# EAGLE board ROV_Main_Board (EAGLE 7.5.0), part 1 of 2
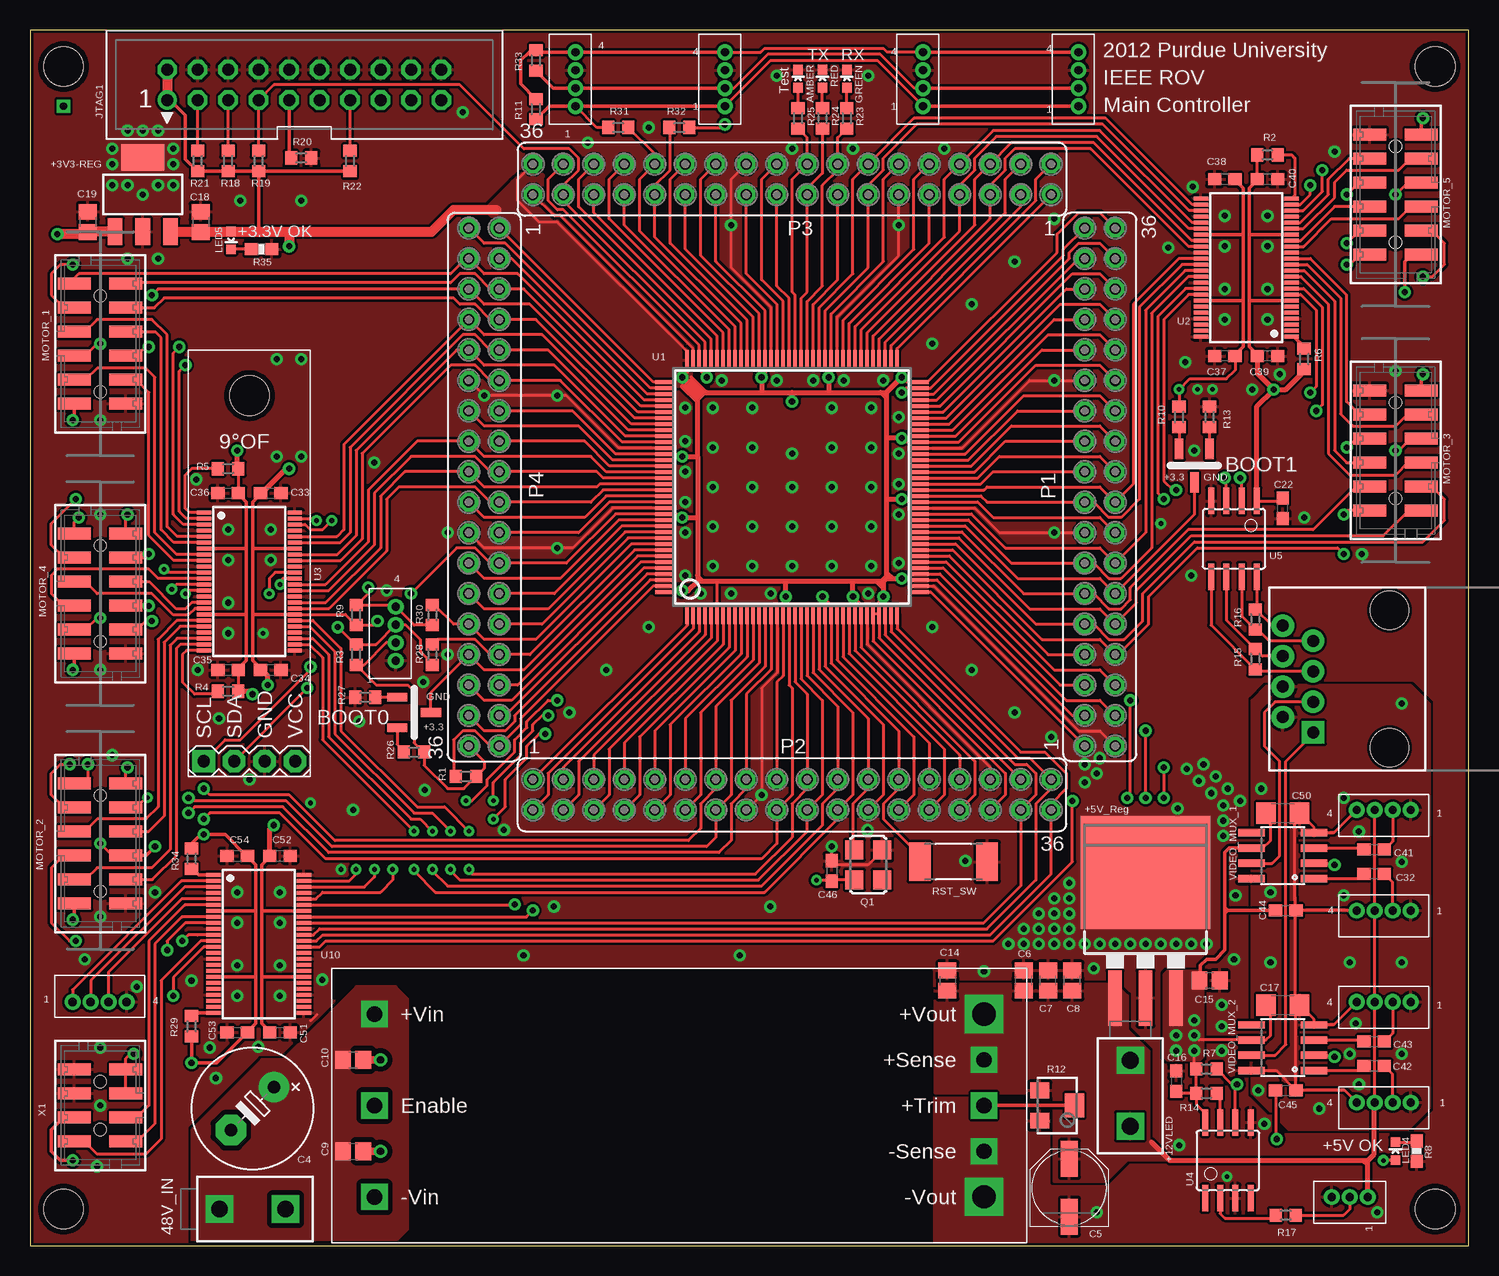
[diagram p2: board, top side]
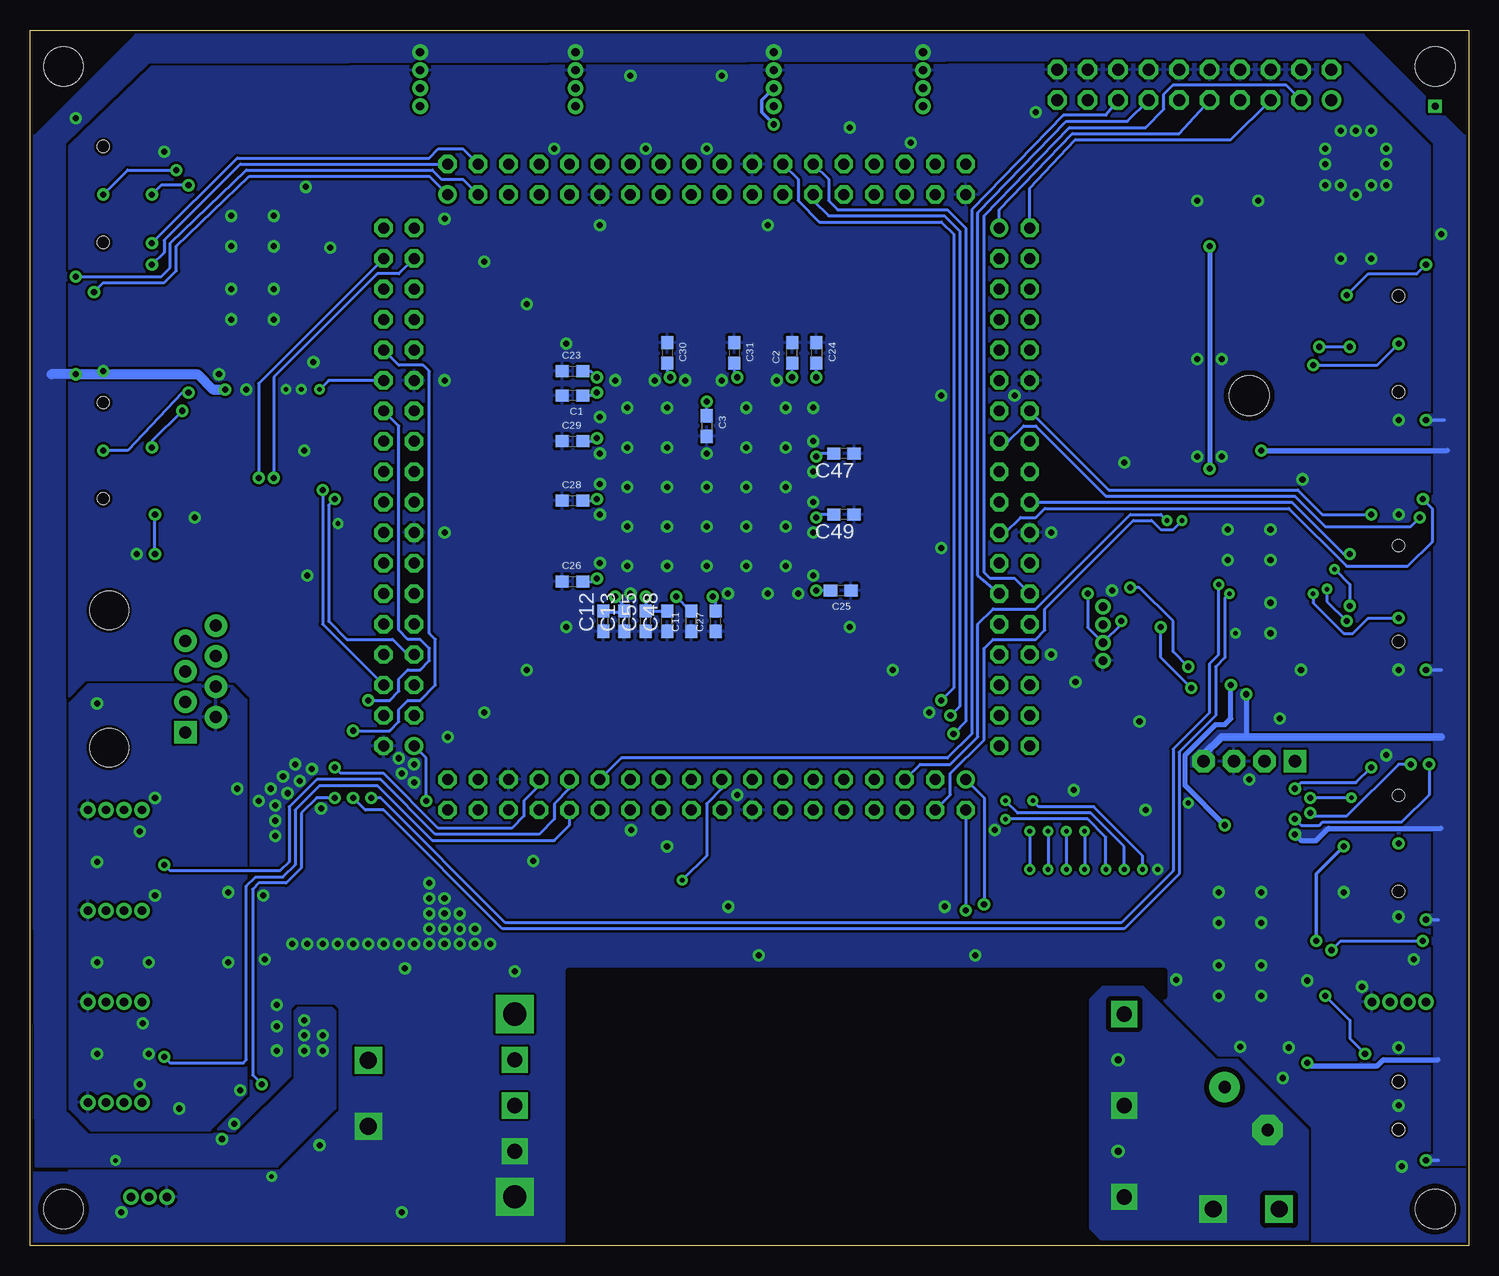
[diagram p3: board, bottom side, seen from below]

Size 119.89 x 101.35 mm. Coordinates in mm from the lower left corner, seen from the top.
Outline: 0,0 119.89,0 119.89,101.35 0,101.35 0,0
Copper layers (1*16): Top 0.035mm / dielectric 1.5mm / Bottom 0.035mm
Design rules "default": minimum track width 8mil, minimum drill 20mil, track to track 8mil, track to pad 8mil, pad to pad 8mil, via to via 8mil, smd to smd 8mil, copper to edge 10mil, drill to drill 8mil, minimum pad ring 12mil, minimum via ring 10mil, stop-mask expansion 4mil, vias tented up to drill 25mil, thermal gap 10mil
tRestrict: area 25.4,0 to 74.9,22.9
bRestrict: area 25.4,0 to 74.9,22.9; 2 lines

## Footprints (pad centres in the part's own frame; a part is rotated, then mirrored left to right if it is on the bottom)
5566-02B = drill 1.4 pad 2.286 square: P$1 0,-2.75; P$2 0,2.75
SOT223 = smd 1.219 x 2.235: 1 -2.311,-3.099; 2 0,-3.099; 3 2.311,-3.099 | smd 3.6 x 2.2: 4 0,3.099
DDPAK-3PIN = smd 1.15 x 4.6: P$1 -2.54,-5.775; P$2 0,-5.775; P$3 2.54,-5.775 | smd 10.8 x 9.4: P$4 0,4.7
LED-0603 = smd 0.8 x 0.8: A 0,-0.75; C 0,0.75
C0603 = smd 1.1 x 1: 1 -0.85,0; 2 0.85,0
E5-10,5 = drill 1.016 pad 2.54: + -2.54,0 | drill 1.016 pad 2.54 octagon: - 2.54,0
PANASONIC_D = smd 3 x 1.4: + 2.4,0; - -2.4,0
C0805 = smd 1.3 x 1.5: 1 -0.85,0; 2 0.85,0
C1206 = smd 1.6 x 1.8: 1 -1.4,0; 2 1.4,0
4PIN_JST = drill 0.7: P$1 0,0; P$2 0,-1.5; P$3 0,-3; P$4 0,-4.5
3PIN_JST = drill 0.7: P$1 0,1.5; P$2 0,0; P$3 0,-1.5
STAND-OFF = hole 3.302: 0,0
JTAG-ARM = drill 1: 1 -11.43,-1.27 | drill 1 octagon: 2 -11.43,1.27; 3 -8.89,-1.27; 4 -8.89,1.27; 5 -6.35,-1.27; 6 -6.35,1.27; 7 -3.81,-1.27; 8 -3.81,1.27; 9 -1.27,-1.27; 10 -1.27,1.27; 11 1.27,-1.27; 12 1.27,1.27; 13 3.81,-1.27; 14 3.81,1.27; 15 6.35,-1.27; 16 6.35,1.27; 17 8.89,-1.27; 18 8.89,1.27; 19 11.43,-1.27; 20 11.43,1.27
87832-12 = smd 1 x 2.75: 1 -5,-2.15; 2 -5,2.15; 3 -3,-2.15; 4 -3,2.15; 5 -1,-2.15; 6 -1,2.15; 7 1,-2.15; 8 1,2.15; 9 3,-2.15; 10 3,2.15; 11 5,-2.15; 12 5,2.15 | hole 1: -4,0; 4,0
FE18-2 = drill 0.914: 1 -21.59,1.27 | drill 0.914 octagon: 2 -21.59,-1.27; 3 -19.05,1.27; 4 -19.05,-1.27; 5 -16.51,1.27; 6 -16.51,-1.27; 7 -13.97,1.27; 8 -13.97,-1.27; 9 -11.43,1.27; 10 -11.43,-1.27; 11 -8.89,1.27; 12 -8.89,-1.27; 13 -6.35,1.27; 14 -6.35,-1.27; 15 -3.81,1.27; 16 -3.81,-1.27; 17 -1.27,1.27; 18 -1.27,-1.27; 19 1.27,1.27; 20 1.27,-1.27; 21 3.81,1.27; 22 3.81,-1.27; 23 6.35,1.27; 24 6.35,-1.27; 25 8.89,1.27; 26 8.89,-1.27; 27 11.43,1.27; 28 11.43,-1.27; 29 13.97,1.27; 30 13.97,-1.27; 31 16.51,1.27; 32 16.51,-1.27; 33 19.05,1.27; 34 19.05,-1.27; 35 21.59,1.27; 36 21.59,-1.27
ASF = smd 1.6 x 1.5: 1 -1.25,-1.15; 2 1.25,-1.15; 3 1.25,1.15; 4 -1.25,1.15
R0603 = smd 1 x 1.1: 1 -0.85,0; 2 0.85,0
0603-RES = smd 1.1 x 1: 1 -0.85,0; 2 0.85,0
SM-42/43W = smd 1.3 x 1.6: 1 -1.27,-1.45; 3 1.27,-1.45 | smd 2 x 1.6: 2 0,1.45
R2512 = smd 1.8 x 3.2: 1 -2.8,0; 2 2.8,0
SQFP-S-20X20-144 = smd 0.3 x 1.6: 1 -8.75,-10.6; 2 -8.25,-10.6; 3 -7.75,-10.6; 4 -7.25,-10.6; 5 -6.75,-10.6; 6 -6.25,-10.6; 7 -5.75,-10.6; 8 -5.25,-10.6; 9 -4.75,-10.6; 10 -4.25,-10.6; 11 -3.75,-10.6; 12 -3.25,-10.6; 13 -2.75,-10.6; 14 -2.25,-10.6; 15 -1.75,-10.6; 16 -1.25,-10.6; 17 -0.75,-10.6; 18 -0.25,-10.6; 19 0.25,-10.6; 20 0.75,-10.6; 21 1.25,-10.6; 22 1.75,-10.6; 23 2.25,-10.6; 24 2.75,-10.6; 25 3.25,-10.6; 26 3.75,-10.6; 27 4.25,-10.6; 28 4.75,-10.6; 29 5.25,-10.6; 30 5.75,-10.6; 31 6.25,-10.6; 32 6.75,-10.6; 33 7.25,-10.6; 34 7.75,-10.6; 35 8.25,-10.6; 36 8.75,-10.6; 73 8.75,10.6; 74 8.25,10.6; 75 7.75,10.6; 76 7.25,10.6; 77 6.75,10.6; 78 6.25,10.6; 79 5.75,10.6; 80 5.25,10.6; 81 4.75,10.6; 82 4.25,10.6; 83 3.75,10.6; 84 3.25,10.6; 85 2.75,10.6; 86 2.25,10.6; 87 1.75,10.6; 88 1.25,10.6; 89 0.75,10.6; 90 0.25,10.6; 91 -0.25,10.6; 92 -0.75,10.6; 93 -1.25,10.6; 94 -1.75,10.6; 95 -2.25,10.6; 96 -2.75,10.6; 97 -3.25,10.6; 98 -3.75,10.6; 99 -4.25,10.6; 100 -4.75,10.6; 101 -5.25,10.6; 102 -5.75,10.6; 103 -6.25,10.6; 104 -6.75,10.6; 105 -7.25,10.6; 106 -7.75,10.6; 107 -8.25,10.6; 108 -8.75,10.6 | smd 1.6 x 0.3: 37 10.6,-8.75; 38 10.6,-8.25; 39 10.6,-7.75; 40 10.6,-7.25; 41 10.6,-6.75; 42 10.6,-6.25; 43 10.6,-5.75; 44 10.6,-5.25; 45 10.6,-4.75; 46 10.6,-4.25; 47 10.6,-3.75; 48 10.6,-3.25; 49 10.6,-2.75; 50 10.6,-2.25; 51 10.6,-1.75; 52 10.6,-1.25; 53 10.6,-0.75; 54 10.6,-0.25; 55 10.6,0.25; 56 10.6,0.75; 57 10.6,1.25; 58 10.6,1.75; 59 10.6,2.25; 60 10.6,2.75; 61 10.6,3.25; 62 10.6,3.75; 63 10.6,4.25; 64 10.6,4.75; 65 10.6,5.25; 66 10.6,5.75; 67 10.6,6.25; 68 10.6,6.75; 69 10.6,7.25; 70 10.6,7.75; 71 10.6,8.25; 72 10.6,8.75; 109 -10.6,8.75; 110 -10.6,8.25; 111 -10.6,7.75; 112 -10.6,7.25; 113 -10.6,6.75; 114 -10.6,6.25; 115 -10.6,5.75; 116 -10.6,5.25; 117 -10.6,4.75; 118 -10.6,4.25; 119 -10.6,3.75; 120 -10.6,3.25; 121 -10.6,2.75; 122 -10.6,2.25; 123 -10.6,1.75; 124 -10.6,1.25; 125 -10.6,0.75; 126 -10.6,0.25; 127 -10.6,-0.25; 128 -10.6,-0.75; 129 -10.6,-1.25; 130 -10.6,-1.75; 131 -10.6,-2.25; 132 -10.6,-2.75; 133 -10.6,-3.25; 134 -10.6,-3.75; 135 -10.6,-4.25; 136 -10.6,-4.75; 137 -10.6,-5.25; 138 -10.6,-5.75; 139 -10.6,-6.25; 140 -10.6,-6.75; 141 -10.6,-7.25; 142 -10.6,-7.75; 143 -10.6,-8.25; 144 -10.6,-8.75
TSSOP48 = smd 0.32 x 1.2: 1 -5.75,-3.775; 2 -5.25,-3.775; 3 -4.75,-3.775; 4 -4.25,-3.775; 5 -3.75,-3.775; 6 -3.25,-3.775; 7 -2.75,-3.775; 8 -2.25,-3.775; 9 -1.75,-3.775; 10 -1.25,-3.775; 11 -0.75,-3.775; 12 -0.25,-3.775; 13 0.25,-3.775; 14 0.75,-3.775; 15 1.25,-3.775; 16 1.75,-3.775; 17 2.25,-3.775; 18 2.75,-3.775; 19 3.25,-3.775; 20 3.75,-3.775; 21 4.25,-3.775; 22 4.75,-3.775; 23 5.25,-3.775; 24 5.75,-3.775; 25 5.75,3.775; 26 5.25,3.775; 27 4.75,3.775; 28 4.25,3.775; 29 3.75,3.775; 30 3.25,3.775; 31 2.75,3.775; 32 2.25,3.775; 33 1.75,3.775; 34 1.25,3.775; 35 0.75,3.775; 36 0.25,3.775; 37 -0.25,3.775; 38 -0.75,3.775; 39 -1.25,3.775; 40 -1.75,3.775; 41 -2.25,3.775; 42 -2.75,3.775; 43 -3.25,3.775; 44 -3.75,3.775; 45 -4.25,3.775; 46 -4.75,3.775; 47 -5.25,3.775; 48 -5.75,3.775
SOIC8 = smd 0.5 x 2.2: 1 -1.905,-3.154; 2 -0.645,-3.154; 3 0.625,-3.154; 4 1.895,-3.154; 5 1.905,3.154; 6 0.635,3.154; 7 -0.635,3.154; 8 -1.905,3.154
RJ45-8 = drill 1 pad 1.88 square: 1 -4.445,6.35 | drill 1 pad 1.88: 2 -3.175,8.89; 3 -1.905,6.35; 4 -0.635,8.89; 5 0.635,6.35; 6 1.905,8.89; 7 3.175,6.35; 8 4.445,8.89 | hole 3.2: -5.715,0; 5.715,0
9DOF-SFE = drill 1.016 pad 1.88 octagon: GND 1.27,3.81; SDA 1.27,6.35; VCC 1.27,1.27 | drill 1.016 pad 1.88 square: SCL 1.27,8.89 | hole 3.302: 31.75,5.08
1X3-1.27-SMD = smd 0.71 x 1.7: P$1 -1.27,1.4; P$2 0,-1.4; P$3 1.27,1.4
EIGHTH-BRICK = drill 1.27 pad 2.184 square: ENABLE 3.556,11.43; SENSE(+) 54.356,15.24; SENSE(-) 54.356,7.62; TRIM 54.356,11.43; VIN(+) 3.556,19.05; VIN(-) 3.556,3.81 | drill 1.93 pad 3.175 square: VOUT(+) 54.356,19.05; VOUT(-) 54.356,3.81
SOIC8' = smd 0.61 x 2.21: 1 -1.905,-2.616; 2 -0.635,-2.616; 3 0.635,-2.616; 4 1.905,-2.616; 5 1.905,2.616; 6 0.635,2.616; 7 -0.635,2.616; 8 -1.905,2.616
87832-08 = smd 1 x 2.75: 1 -3,-2.15; 2 -3,2.15; 3 -1,-2.15; 4 -1,2.15; 5 1,-2.15; 6 1,2.15; 7 3,-2.15; 8 3,2.15 | hole 1: -2,0; 2,0

## Placement (x,y rotation side)
48V_IN  MINIFITJR-2X1-VERT  [5566-02B]  18.54,3.05 90 top
+3V3-REG  SPX3940SOT223  [SOT223]  9.4,87.63 0 top
+5V  SPX29150  [DDPAK-3PIN]  92.96,26.42 0 top
+12VLED  MINIFITJR-2X1-VERT  [5566-02B]  91.69,12.7 0 top
AMBER  [LED-0603]  64.01,97.28 0 top
C1  2.2uF  [C0603]  74.68,70.87 180 bottom
C2  2.2uF  [C0603]  56.39,74.42 90 bottom
C3  4.7uF  [C0603]  63.5,68.33 270 bottom
C4  100uF  [E5-10,5]  18.54,11.43 225 top
C5  47uf  [PANASONIC_D]  86.61,4.83 90 top
C6  10uF  [C0805]  82.8,22.1 90 top
C7  10uF  [C0805]  84.84,22.1 90 top
C8  1uF  [C0805]  86.87,22.1 90 top
C9  1uF  [C0805]  26.92,7.87 0 top
C10  1uF  [C0805]  26.92,15.49 0 top
C11  0.1uF  [C0603]  64.77,52.07 90 bottom
C12  10nF  [C0603]  72.14,52.07 90 bottom
C13  1uF  [C0603]  70.36,52.07 90 bottom
C14  6.8uF  [C0805]  76.45,22.1 270 top
C15  10uF  [C0805]  98.3,22.1 180 top
C16  0.1uF  [C0603]  95.5,13.72 270 top
C17  47uF  [C1206]  104.39,20.07 0 top
C18  10uF  [C0805]  14.22,85.34 270 top
C19  6.8uF  [C0805]  4.83,85.34 270 top
C22  0.01uF  [C0603]  104.39,61.47 90 top
C23  0.1uF  [C0603]  74.68,72.9 0 bottom
C24  0.1uF  [C0603]  54.36,74.42 270 bottom
C25  0.1uF  [C0603]  52.32,54.61 180 bottom
C26  0.1uF  [C0603]  74.68,55.37 0 bottom
C27  0.1uF  [C0603]  62.74,52.07 90 bottom
C28  0.1uF  [C0603]  74.68,62.1 0 bottom
C29  0.1uF  [C0603]  74.68,67.06 0 bottom
C30  0.1uF  [C0603]  66.8,74.42 270 bottom
C31  0.1uF  [C0603]  61.21,74.42 270 bottom
C32  0.01uF  [C0603]  112.01,30.99 180 top
C33  0.1uF  [C0603]  20.07,62.74 0 top
C34  0.1uF  [C0603]  20.07,48.01 0 top
C35  0.1uF  [C0603]  16.51,48.01 0 top
C36  0.1uF  [C0603]  16.51,62.74 0 top
C37  0.1uF  [C0603]  99.57,74.17 180 top
C38  0.1uF  [C0603]  99.57,88.9 180 top
C39  0.1uF  [C0603]  103.12,74.17 180 top
C40  0.1uF  [C0603]  103.12,88.9 180 top
C41  0.01uF  [C0603]  112.01,33.02 0 top
C42  0.01uF  [C0603]  112.01,14.99 180 top
C43  0.01uF  [C0603]  112.01,17.02 0 top
C44  0.1uF  [C0603]  104.65,27.94 0 top
C45  0.1uF  [C0603]  104.65,12.95 0 top
C46  0.01uF  [C0603]  66.8,31.24 270 top
C47  0.1uF  [C0603]  52.07,66.04 180 bottom
C48  10nF  [C0603]  66.8,52.07 90 bottom
C49  0.1uF  [C0603]  52.07,60.96 180 bottom
C50  47uF  [C1206]  104.39,36.07 0 top
C51  0.1uF  [C0603]  20.83,17.78 0 top
C52  0.1uF  [C0603]  20.83,32.51 0 top
C53  0.1uF  [C0603]  17.27,17.78 0 top
C54  0.1uF  [C0603]  17.27,32.51 0 top
C55  1uF  [C0603]  68.58,52.07 90 bottom
COMPASS_TILT  4PIN4PIN_JST  [4PIN_JST]  30.48,48.77 180 top
DC/DC_I2C1  4PIN4PIN_JST  [4PIN_JST]  74.42,95 180 top
DC/DC_I2C2  4PIN4PIN_JST  [4PIN_JST]  87.38,95 180 top
DC/DC_I2C3  4PIN4PIN_JST  [4PIN_JST]  45.47,95 180 top
DC/DC_I2C4  4PIN4PIN_JST  [4PIN_JST]  57.91,95 180 top
GREEN  [LED-0603]  68.07,97.28 0 top
IND_SENSE  3PIN3PIN_JST  [3PIN_JST]  109.98,4.06 270 top
JP1  STAND-OFF  [STAND-OFF]  2.79,98.3 0 top
JP2  STAND-OFF  [STAND-OFF]  117.09,98.3 0 top
JP3  STAND-OFF  [STAND-OFF]  2.79,3.05 0 top
JP4  STAND-OFF  [STAND-OFF]  117.09,3.05 0 top
JTAG1  JTAG-ARM  [JTAG-ARM]  22.86,96.77 0 top
LED4  Blue  [LED-0603]  113.79,7.87 0 top
LED5  Pink  [LED-0603]  16.76,83.82 180 top
LED_PWM  4PIN4PIN_JST  [4PIN_JST]  3.56,20.32 90 top
MOTOR_1  87832-12  [87832-12]  5.84,75.18 270 top
MOTOR_2  87832-12  [87832-12]  5.84,33.53 270 top
MOTOR_3  87832-12  [87832-12]  113.79,66.29 90 top
MOTOR_4  87832-12  [87832-12]  5.84,54.36 270 top
MOTOR_5  87832-12  [87832-12]  113.79,87.63 90 top
P1  [FE18-2]  89.15,63.25 90 top
P2  [FE18-2]  63.5,37.59 0 top
P3  [FE18-2]  63.5,88.9 180 top
P4  [FE18-2]  37.85,63.25 270 top
Q1  ASFL1  [ASF]  69.85,31.75 90 top
R1  0 ohm  [R0603]  36.32,39.12 0 top
R2  1k  [R0603]  103.12,90.93 0 top
R3  4.7k  [R0603]  27.18,49.28 270 top
R4  1k  [R0603]  16.51,46.23 180 top
R5  1k  [R0603]  16.51,64.77 0 top
R6  1k  [R0603]  106.17,73.91 270 top
R7  1k  [R0603]  98.04,14.73 0 top
R8  100  [0603-RES]  115.57,7.87 90 top
R9  4.7k  [R0603]  27.18,52.58 270 top
R10  1k  [R0603]  95.76,69.09 90 top
R11  4.7k  [R0603]  42.16,94.74 90 top
R12  [SM-42/43W]  85.6,11.68 270 top
R13  1k  [R0603]  98.3,69.09 270 top
R14  1k  [R0603]  98.04,12.7 180 top
R15  120  [R0603]  102.11,48.9 270 top
R16  120  [R0603]  102.11,52.2 270 top
R17  1k  [R0603]  104.65,2.54 180 top
R18  10k  [R0603]  16.51,90.42 270 top
R19  10k  [R0603]  19.05,90.42 270 top
R20  10k  [R0603]  22.61,90.68 180 top
R21  10k  [R0603]  13.97,90.42 270 top
R22  10k  [R0603]  26.67,90.42 270 top
R23  200  [R0603]  68.07,93.98 270 top
R24  200  [R0603]  66.04,93.98 270 top
R25  80  [R0603]  64.01,93.98 270 top
R26  1k  [R0603]  32,41.15 0 top
R27  1k  [R0603]  27.94,45.72 0 top
R28  0  [R0603]  33.53,49.28 270 top
R29  1k  [R0603]  13.46,18.29 90 top
R30  0  [R0603]  33.53,52.58 270 top
R31  0  [R0603]  49.02,93.22 180 top
R32  0  [R0603]  54.1,93.22 0 top
R33  4.7k  [R0603]  42.16,98.81 90 top
R34  1k  [R0603]  13.46,32.26 270 top
R35  80  [0603-RES]  19.3,83.06 180 top
RED  [LED-0603]  66.04,97.28 0 top
RST_SW  0  [R2512]  76.96,32 180 top
U1  [SQFP-S-20X20-144]  63.5,63.25 0 top
U2  74ALVC16425  [TSSOP48]  101.35,81.53 90 top
U3  74ALVC16425  [TSSOP48]  18.29,55.37 270 top
U4  HCPL-600  [SOIC8]  99.82,7.11 0 top
U5  LTC1690SOIC8  [SOIC8]  100.33,58.93 180 top
U10  74ALVC16425  [TSSOP48]  19.05,25.15 270 top
U$6  RJ45-8PTH  [RJ45-8]  113.28,47.24 90 top
U$7  9DOF-IMU-SFE  [9DOF-SFE]  23.37,39.12 90 top
U$8  1X3-SMD-1.27MM  [1X3-1.27-SMD]  97.03,65.02 0 top
U$9  1X3-SMD-1.27MM  [1X3-1.27-SMD]  32,44.45 90 top
U$11  DC-DC-EIGHTH_BRICK  [EIGHTH-BRICK]  25.15,0.25 0 top
VIDEO_1  4PIN4PIN_JST  [4PIN_JST]  115.06,27.94 270 top
VIDEO_2  4PIN4PIN_JST  [4PIN_JST]  115.06,36.32 270 top
VIDEO_3  4PIN4PIN_JST  [4PIN_JST]  115.06,11.94 270 top
VIDEO_4  4PIN4PIN_JST  [4PIN_JST]  115.06,20.32 270 top
VIDEO_MUX_1  BA765SOIC8  [SOIC8']  104.39,32.51 90 top
VIDEO_MUX_2  BA765SOIC8  [SOIC8']  104.39,16.51 90 top
X1  87832-08  [87832-08]  5.84,11.68 90 top